# Altium schematic sheet MAX_M10M_PINOUT.SchDoc
size B; SheetNumber: 15; SheetTotal: 17
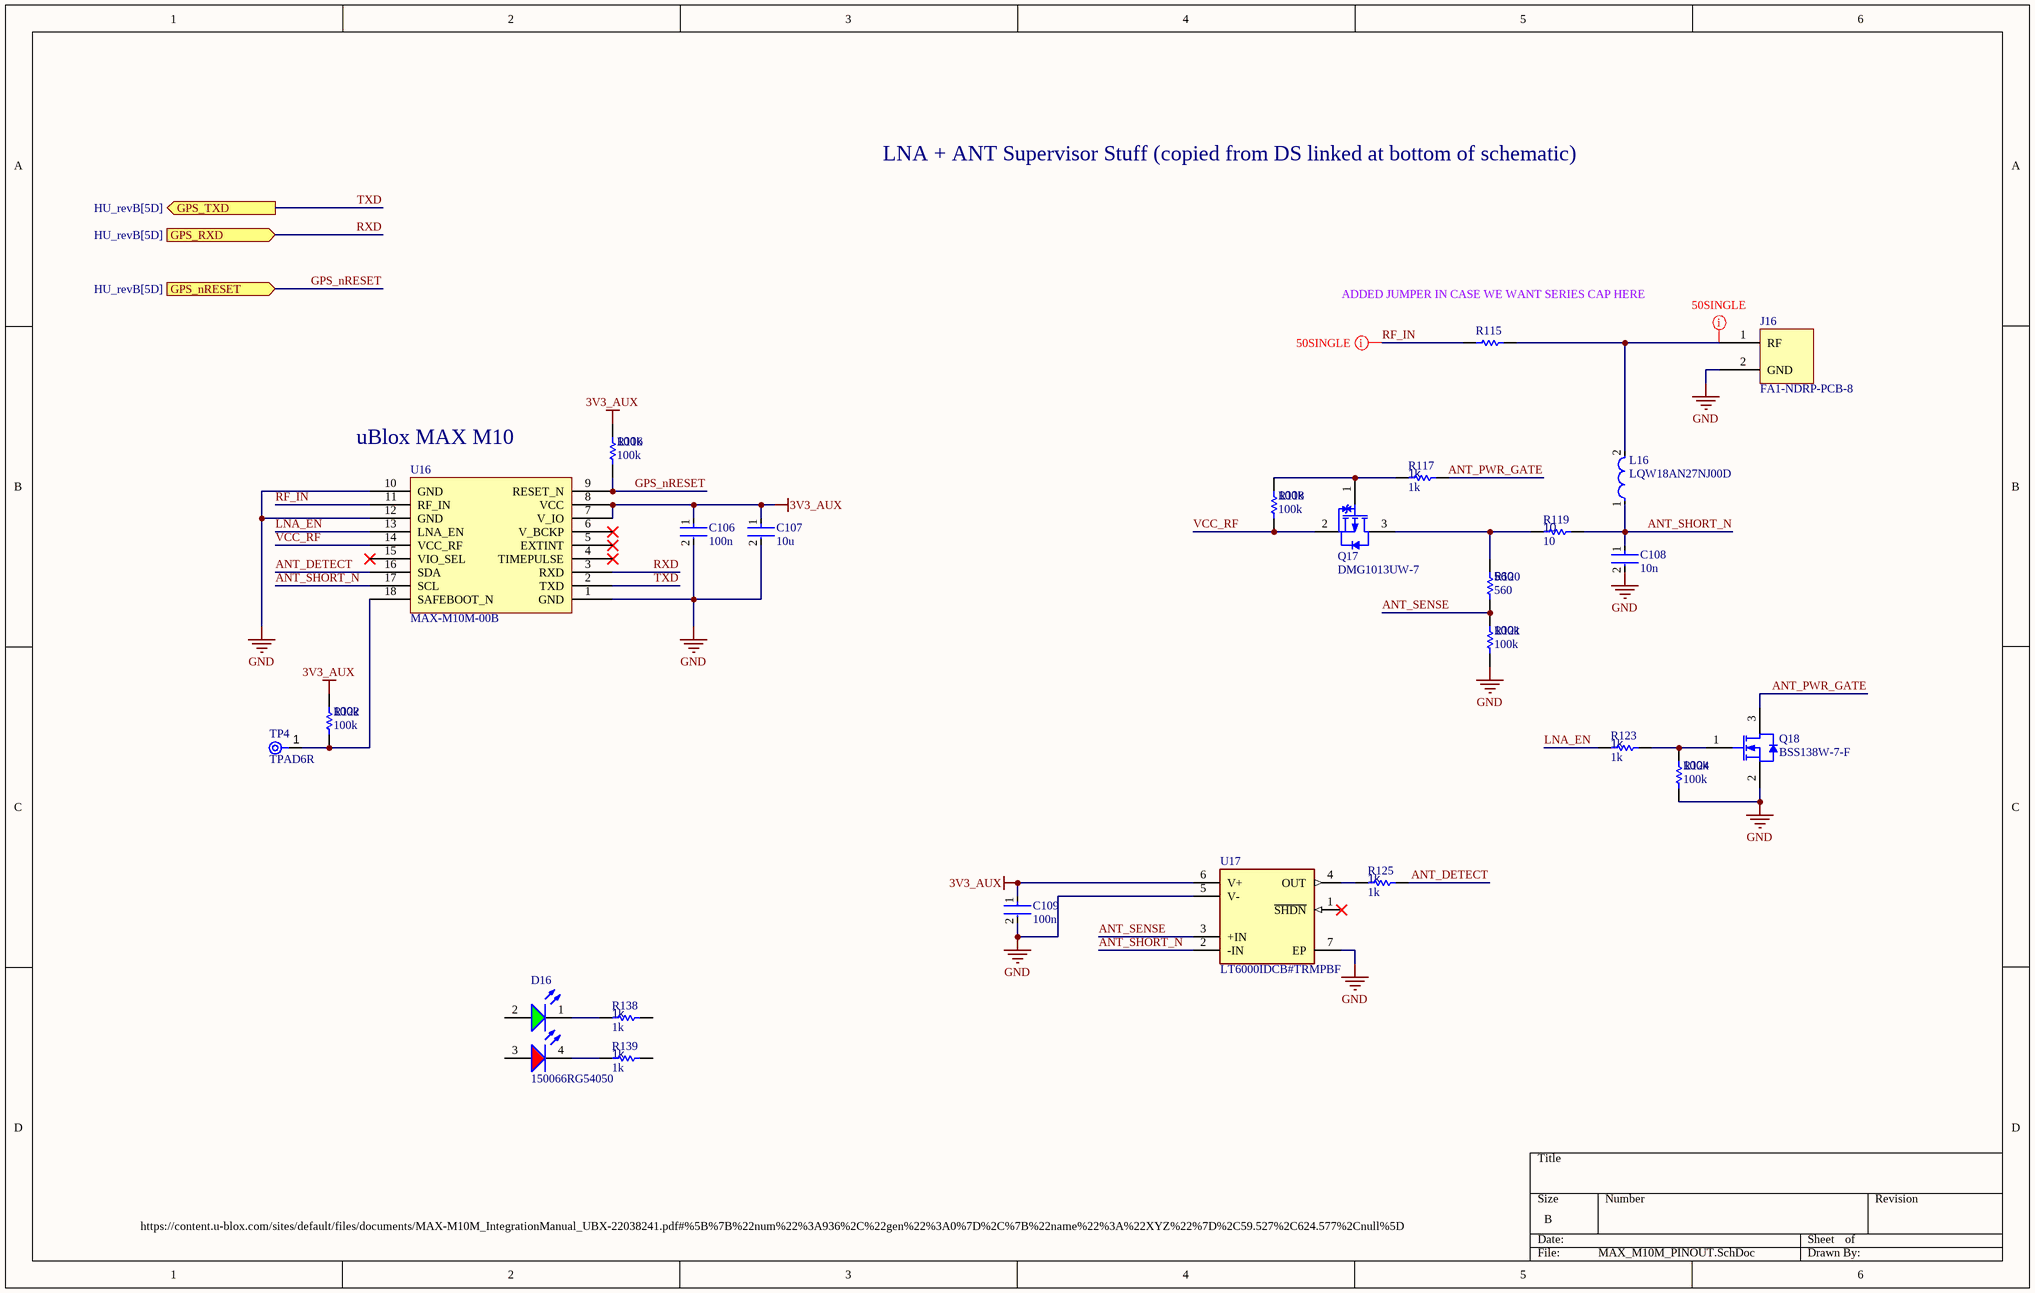
[diagram p0: MAX_M10M_PINOUT.SchDoc]

## Parts
C106  100n  [FP-0402-L_1_0_0_05-W_0_5-IPC_A]
C107  10u  [FP-0402-L_1_0_0_05-W_0_5-IPC_A]
C108  10n  [FP-0402-L_1_0_0_05-W_0_5-IPC_A]
C109  100n  [FP-0402-L_1_0_0_05-W_0_5-IPC_A]
D16  150066RG54050  [WL-SBCD_0606]
J16  FA1-NDRP-PCB-8  [FA1-NDRP-PCB-8-Footprint-1]
L16  LQW18AN27NJ00D  [FP-LQW18AN_00-MFG]
Q17  DMG1013UW-7  [DIOD-SOT323-3_V]
Q18  BSS138W-7-F  [DIOD-SOT323-3_V]
R115  0402 JUMPER  [RESC1005X40X25ML05T05]  (value not drawn)
R116  100k  [R0603B]
R117  1k  [R0603B]
R118  100k  [R0603B]
R119  10  [R0603B]
R120  560  [R0603B]
R121  100k  [R0603B]
R122  100k  [R0603B]
R123  1k  [R0603B]
R124  100k  [R0603B]
R125  1k  [R0603B]
R138  1k  [R0603B]
R139  1k  [R0603B]
TP4  TPAD6R  [New footprint 1]
U16  MAX-M10M-00B  [MAX-M10M-00B-Footprint-1]
U17  LT6000IDCB#TRMPBF  [FP-DCB-6-05-08-1715-MFG]

## Ports
GPS_nRESET (in, see HU_revB[5D]), GPS_RXD (in, see HU_revB[5D]), GPS_TXD (out, see HU_revB[5D])

## Nets
3V3_AUX: C106.1 C107.1 C109.1 R116.1 R122.1 U16.7(V_IO) U16.8(VCC) U17.6(V+)
GND: C106.2 C107.2 C108.2 C109.2 J16.2(GND) Q18.2(S) R121.2 R124.2 U16.1(GND) U16.10(GND) U16.12(GND) U17.5(V-) U17.7(EP)
ANT_DETECT: R125.2 U16.16(SDA)
ANT_PWR_GATE: Q18.3(D) R117.2
ANT_SENSE: R120.2 R121.1 U17.3(+IN)
ANT_SHORT_N: C108.1 L16.1 R119.2 U16.17(SCL) U17.2(-IN)
GPS_nRESET: R116.2 U16.9(RESET_N) ; port GPS_nRESET
LNA_EN: R123.1 U16.13(LNA_EN)
RF_IN: R115.1 U16.11(RF_IN)
RXD: U16.3(RXD) ; port GPS_RXD
TXD: U16.2(TXD) ; port GPS_TXD
VCC_RF: Q17.2(S) R118.2 U16.14(VCC_RF)
NetD16_1: D16.1(K) R138.2
NetD16_4: D16.4(K) R139.2
NetJ16_1: J16.1(RF) L16.2 R115.2
NetQ17_1: Q17.1(G) R117.1 R118.1
NetQ17_3: Q17.3(D) R119.1 R120.1
NetQ18_1: Q18.1(G) R123.2 R124.1
NetR122_2: R122.2 TP4.1(TP) U16.18(SAFEBOOT_N)
NetR125_1: R125.1 U17.4(OUT)

Not connected (* = marked no-connect by the designer): D16 2(A) 3(A); R138 1; R139 1; U16 4(TIMEPULSE)* 5(EXTINT)* 6(V_BCKP)* 15(VIO_SEL)*; U17 1(~{SHDN})*

## Layout directives
net class 50SINGLE: NetJ16_1, RF_IN

## Notes on the sheet
- LNA + ANT Supervisor Stuff (copied from DS linked at bottom of schematic)
- (near R115) ADDED JUMPER IN CASE WE WANT SERIES CAP HERE
- (near U16) uBlox MAX M10
- https://content.u-blox.com/sites/default/files/documents/MAX-M10M_IntegrationManual_UBX-22038241.pdf#%5B%7B%22num%22%3A936%2C%22gen%22%3A0%7D%2C%7B%22name%22%3A%22XYZ%22%7D%2C59.527%2C624.577%2Cnull%5D

## Library data of the parts
C106-C109 = CMP-001-00058-1: LARGE PADS, 0402 CAP, CHANGE COMMENT TO MATCH REAL P/N; Capacitor Type: Ceramic; Min Operating Temperature: -55°C; Mounting Technology: Surface Mount; Pins: 2; Case/Package: 0402; RoHS Compliant: Yes; Max Operating Temperature: 85°C
  C106 C109: Value: 100n
  C107: Value: 10u
  C108: Value: 10n
D16 = CMP-004-00040-2: Led, Red/Grn, 180Mcd/230Mcd, 624Nm/525Nm Rohs Compliant: Yes; Source: rgled.SchLib; Component Type: Standard; Design Item ID: CMP-004-00034-2; Pins: 4
J16 = CMP-002-00054-1: RF F Connector, Male, Board Mount, Solder Terminal, Plug; Connector Type: RF F CONNECTOR; RoHS Compliant: Yes; Mounting Technology: Board
L16 = CMP-06042-013840-1: Wire Wound RF Inductor 27nH ±5% 440mA 0.21Ω 0603 (1608); Shielding: Unshielded; Test Frequency: 100MHz; Q Factor: 40; Self Resonant Frequency: 3.7GHz; DC Resistance (DCR): 210mR; Core Material: Non-Magnetic; Depth: 1mm; Min Operating Temperature: -55°C; Package Quantity: 4000; Inductance: 27nH; Case Code (Metric): 1608; Height - Seated (Max): 0.039inch; Resistor Type: Wirewound; Max DC Current: 440mA; Tolerance: 5%; Length: 1.6mm; Mount: Surface Mount; DC Current: 440mA; Packaging: Tape and Reel; Lead Free: Lead Free; Case Code (Imperial): 0603; Current Rating: 440mA; Width: 0.8mm; Max Operating Temperature: 125°C; Termination: SMD/SMT; Weight: 0.000106oz; Radiation Hardening: No; Height: 0.8mm; Case/Package: 0603; Military Standard: Not
Q17 = CMP-2000-06170-1: P-Channel Enhancement Mode MOSFET, 310 mW, 20 V, -55 to 150 degC, 3-Pin SOT-323, RoHS, Tape and Reel; Manufacturer: Diodes Inc; Qg Gate Charge: 0.622nC; Drain-Source On Resistance-Max: 750mO; Rated Power Dissipation: 310mW; Drain-to-Source Voltage [Vdss]: 20V; Package Reference: SOT323; Datasheet Version: Rev. 3-2, 09/2013; Package Description: 3-Pin Small Outline Transistor, Body 2 x 1.25 mm, Pitch 0.65 mm; Mounting Technology: SurfaceMount; Manufacturer URL: http://www.diodes.com/; Datasheet URL: http://www.diodes.com/_files/datasheets/ds31861.pdf; Channel Type: P-Channel
Q18 = CMP-2000-05968-1: N-Channel Enhancement Mode Mosfet, 50 V, 200 mA, -55 to 150 degC, 6-Pin SOT-323, RoHS, Tape and Reel; Typical Turn-Off Delay Time: 20ns; Number of Channels: 1Channel; Type: EnhancementModeFieldEffectTransistor; Brand: DiodesIncorporated; Vds - Drain-Source Breakdown Voltage: 75V; Vgs - Gate-Source Voltage: 20V; Rds On - Drain-Source Resistance: 1.4Ohms; Transistor Type: 1N-Channel; Configuration: Single; Unit Weight: 0.000212oz; Pd - Power Dissipation: 200mW; Id - Continuous Drain Current: 200mA; Forward Transconductance - Min: 0.1S; Manufacturer URL: http://www.diodes.com/; Series: BSS138; Package Description: 3-Pin Small Outline Transistor, Body 2 x 1.25 mm, Pitch 0.65 mm; Mounting Technology: SurfaceMount; Product Category: MOSFET; RoHS: True; Maximum Operating Temperature: +150C; Height: 1mm; Length: 2.2mm; Technology: Si; Width: 1.35mm; Datasheet URL: http://www.diodes.com/_files/datasheets/ds30206.pdf; Manufacturer: DiodesIncorporated; Package / Case: SOT-323-3; Typical Turn-On Delay Time: 20ns; Transistor Polarity: N-Channel; Factory Pack Quantity: 3000; Packaging: Reel; Product: MOSFETSmallSignal; Datasheet Version: Rev. 11-2, 09/2013; Package Reference: SOT323; Minimum Operating Temperature: -55C; Mounting Style: SMD/SMT; Channel Mode: Enhancement
R115 = CMP-009-00118-2: READ THE NAME; Pins: 2; Component Type: Standard; Design Item ID: CMP-009-00206-2; Source: 0402jump.SchLib; Value: 0402 JUMPER
R116-R125 R138 R139 = CMP-009-00002-14: Resistor
  R116 R118 R121 R122 R124: Value: 100k
  R117 R123 R125 R138 R139: Value: 1k
  R119: Value: 10
  R120: Value: 560
TP4 = CMP-00025-2: Test Point .6mm
U16 = CMP-010-00031-2: Gnss Lcc Rx Mod, Rom, Crystal
U17 = CMP-09116-000039-1: IC OPAMP GP 1 CIRCUIT 6DFN; Number of Elements: 1; Power Supply Rejection Ratio (PSRR): 86dB; Output Current per Channel: 10mA; Gain Bandwidth Product: 60kHz; Operating Supply Current: 20uA; Input Bias Current: 12nA; Voltage Gain: 120dB; Max Supply Voltage: 18V; Input Offset Voltage (Vos): 1.2mV; Min Supply Voltage: 1.8V; Slew Rate: 0.018V/µs; Common Mode Rejection Ratio: 68dB; Packaging: Tape and Reel; Mount: Surface Mount; Case/Package: DFN; Max Operating Temperature: 85°C; Number of Pins: 6; Number of Amplifiers: 1; REACH SVHC: No SVHC; Unity Gain Bandwidth Product: 60kHz; Bandwidth: 60kHz; Lead Free: Lead Free; Number of Circuits: 1; Min Operating Temperature: -40°C; Package Quantity: 1